# EAGLE design slang-lsm6dsl-ruka (EAGLE 9.4.2)

## Sheet 1 of 4: Power management
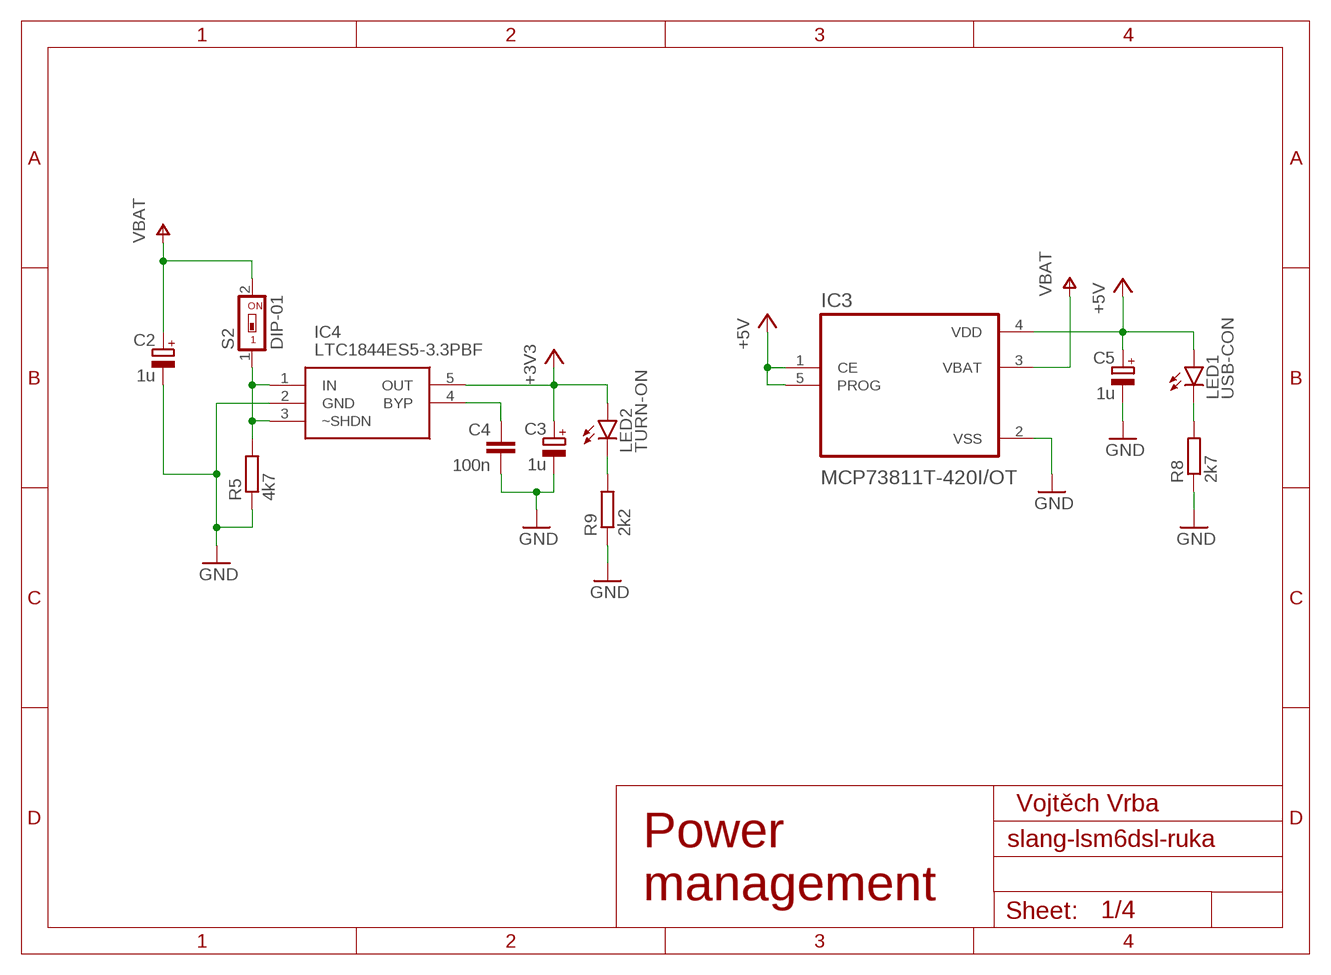
[diagram p0: schematic, sheet 1]

### Parts
C2  1u  CPOL-EUSMCA  [SMC_A]
C3  1u  CPOL-EUSMCA  [SMC_A]
C4  100n  C-EUC0805  [C0805]
C5  1u  CPOL-EUSMCA  [SMC_A]
IC3  MCP73811T-420I/OT  [SOT95P280X145-5N]
IC4  LTC1844ES5-3.3PBF  [SOT95P280X100-5N]
LED1  USB-CON  LEDCHIP-LED0805  [CHIP-LED0805]
LED2  TURN-ON  LEDCHIP-LED0805  [CHIP-LED0805]
R5  4k7  R-EU_R0805  [R0805]
R8  2k7  R-EU_R0805  [R0805]
R9  2k2  R-EU_R0805  [R0805]
S2  DIP-01  SWS001  [SMS-001]

### Nets
+3V3: C3.+ IC4.5(OUT) LED2.A ; also sheet 2,3,4
+5V: C5.+ IC3.1(CE) IC3.4(VDD) IC3.5(PROG) LED1.A ; also sheet 2
GND: C2.- C3.- C4.2 C5.- IC3.2(VSS) IC4.2(GND) R5.1 R8.1 R9.1 ; also sheet 2,3,4
N$5: LED1.C R8.2
N$7: C4.1 IC4.4(BYP)
N$9: IC4.1(IN) IC4.3(~SHDN) R5.2 S2.1
N$10: LED2.C R9.2
V+: C2.+ IC3.3(VBAT) S2.2 ; supply symbol labelled VBAT ; also sheet 2,4

### Notes on the sheet
- Vojtěch Vrba
- Power
  management

## Sheet 2 of 4: Connectors
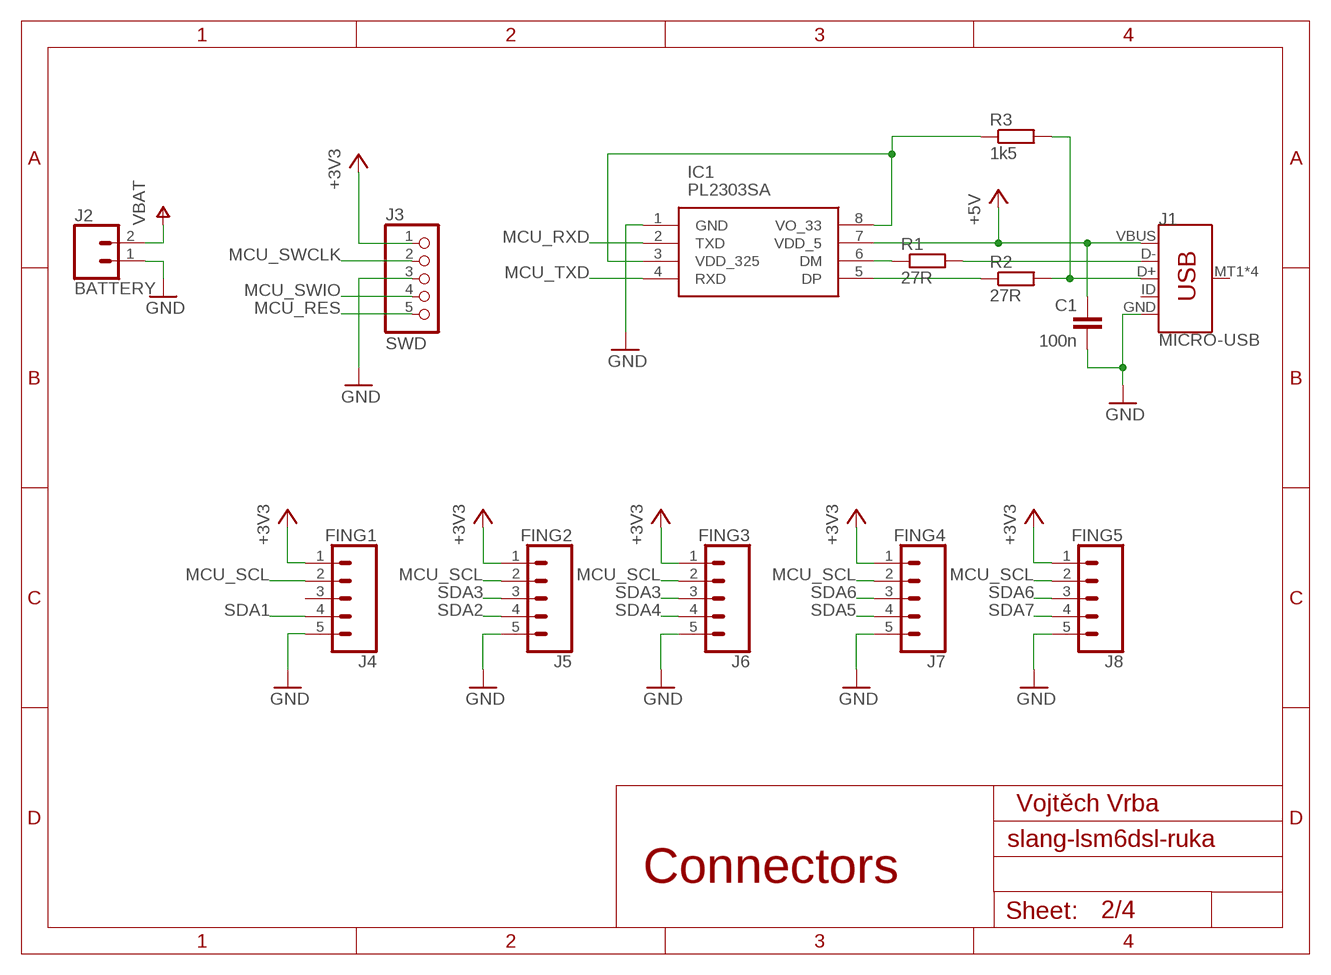
[diagram p1: schematic, sheet 2]

### Parts
C1  100n  C-EUC0805  [C0805]
IC1  PL2303SA  [SOIC127P600X170-8N]
J1  MICRO-USB  USB_MICRO-B_SMT  [USB-MICROB]
J2  BATTERY  CONN_025MM  [SCREWTERMINAL-5MM-2]
J3  SWD  PINHD-1X5/90  [1X05/90]
J4  FING1  CONN_051.27MM  [1X05_1.27MM]
J5  FING2  CONN_051.27MM  [1X05_1.27MM]
J6  FING3  CONN_051.27MM  [1X05_1.27MM]
J7  FING4  CONN_051.27MM  [1X05_1.27MM]
J8  FING5  CONN_051.27MM  [1X05_1.27MM]
R1  27R  R-EU_R0805  [R0805]
R2  27R  R-EU_R0805  [R0805]
R3  1k5  R-EU_R0805  [R0805]

### Nets
+3V3: J3.1 J4.1 J5.1 J6.1 J7.1 J8.1 ; also sheet 1,3,4
+5V: C1.1 IC1.7(VDD_5) J1.VBUS ; also sheet 1
GND: C1.2 IC1.1(GND) J1.GND J2.1 J3.3 J4.5 J5.5 J6.5 J7.5 J8.5 ; also sheet 1,3,4
MCU_RES: J3.5 ; also sheet 4
MCU_RXD: IC1.2(TXD) ; also sheet 4
MCU_SCL: J4.2 J5.2 J6.2 J7.2 J8.2 ; also sheet 3,4
MCU_SWCLK: J3.2 ; also sheet 4
MCU_SWIO: J3.4 ; also sheet 4
MCU_TXD: IC1.4(RXD) ; also sheet 4
N$1: IC1.6(DM) R1.1
N$2: J1.D- R1.2
N$3: J1.D+ R2.2 R3.2
N$4: IC1.5(DP) R2.1
N$6: IC1.3(VDD_325) IC1.8(VO_33) R3.1
SDA1: J4.4 ; also sheet 4
SDA2: J5.4 ; also sheet 4
SDA3: J5.3 J6.3 ; also sheet 4
SDA4: J6.4 ; also sheet 4
SDA5: J7.4 ; also sheet 4
SDA6: J7.3 J8.3 ; also sheet 4
SDA7: J8.4 ; also sheet 4
V+: J2.2 ; supply symbol labelled VBAT ; also sheet 1,4
Unconnected: J1.ID J1.MT1(SHIELD) J1.MT2(SHIELD) J1.P$1(SHIELD) J1.P$2(SHIELD) J4.3

### Notes on the sheet
- Vojtěch Vrba
- Connectors

## Sheet 3 of 4: Sensors
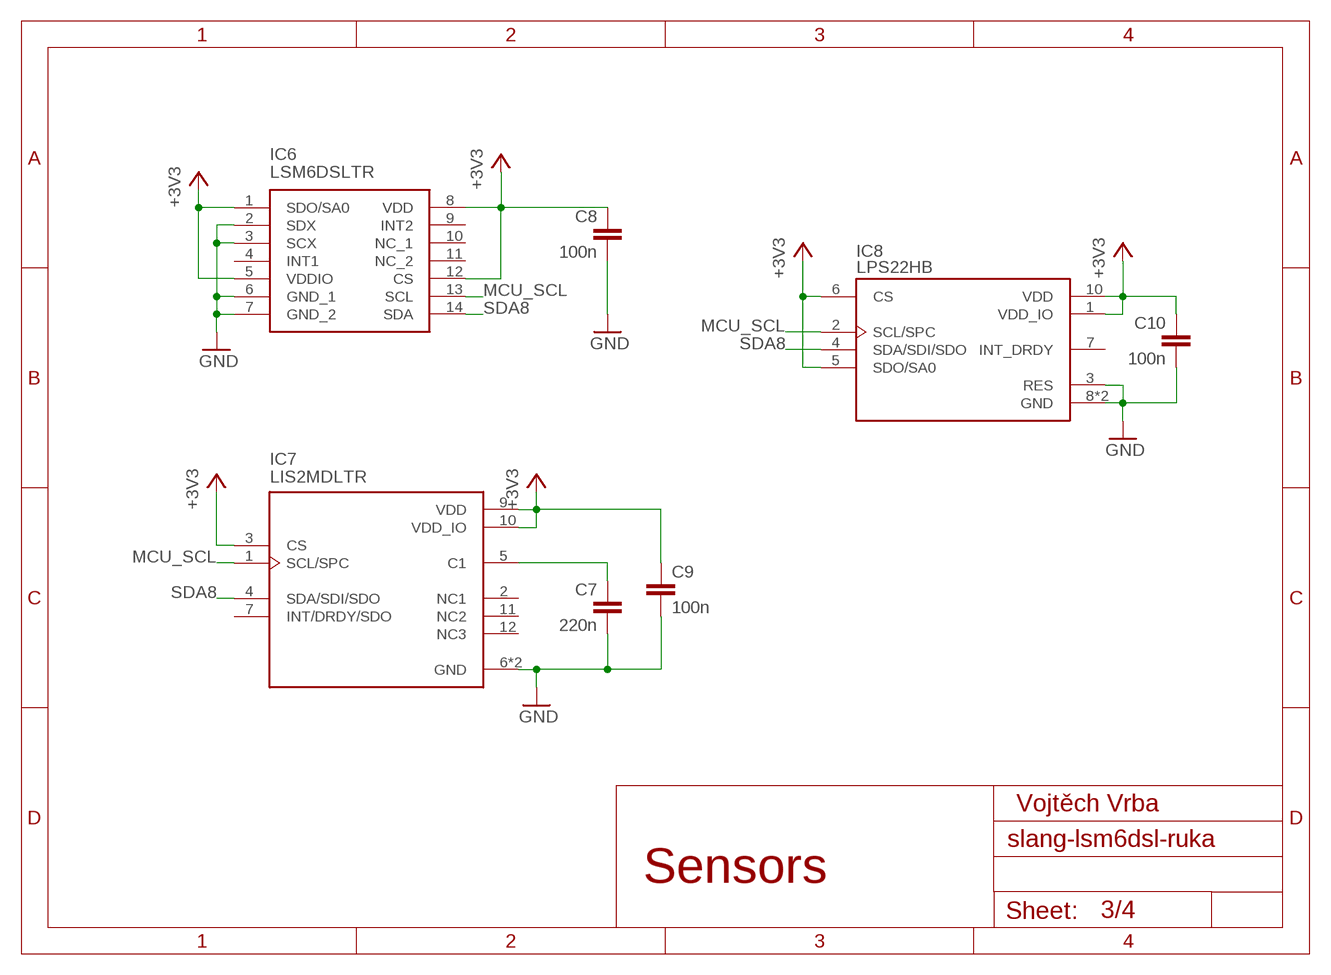
[diagram p2: schematic, sheet 3]

### Parts
C7  220n  C-EUC0805  [C0805]
C8  100n  C-EUC0805  [C0805]
C9  100n  C-EUC0805  [C0805]
C10  100n  C-EUC0805  [C0805]
IC6  LSM6DSLTR  [LGA-14(2.5X3X0.86)]
IC7  LIS2MDLTR  [PQFN50P200X200X70-12N]
IC8  LPS22HB  [LGA10R50P2X3_200X200X80]

### Nets
+3V3: C8.1 C9.1 C10.1 IC6.1(SDO/SA0) IC6.5(VDDIO) IC6.8(VDD) IC6.12(CS) IC7.3(CS) IC7.9(VDD) IC7.10(VDD_IO) IC8.1(VDD_IO) IC8.5(SDO/SA0) IC8.6(CS) IC8.10(VDD) ; also sheet 1,2,4
GND: C7.2 C8.2 C9.2 C10.2 IC6.2(SDX) IC6.3(SCX) IC6.6(GND_1) IC6.7(GND_2) IC7.6(GND) IC7.8(GND) IC8.3(RES) IC8.8(GND) IC8.9(GND) ; also sheet 1,2,4
MCU_SCL: IC6.13(SCL) IC7.1(SCL/SPC) IC8.2(SCL/SPC) ; also sheet 2,4
N$8: C7.1 IC7.5(C1)
SDA8: IC6.14(SDA) IC7.4(SDA/SDI/SDO) IC8.4(SDA/SDI/SDO) ; also sheet 4
Unconnected: IC6.4(INT1) IC6.9(INT2) IC6.10(NC_1) IC6.11(NC_2) IC7.2(NC1) IC7.7(INT/DRDY/SDO) IC7.11(NC2) IC7.12(NC3) IC8.7(INT_DRDY)

### Notes on the sheet
- Vojtěch Vrba
- Sensors

## Sheet 4 of 4: MCU
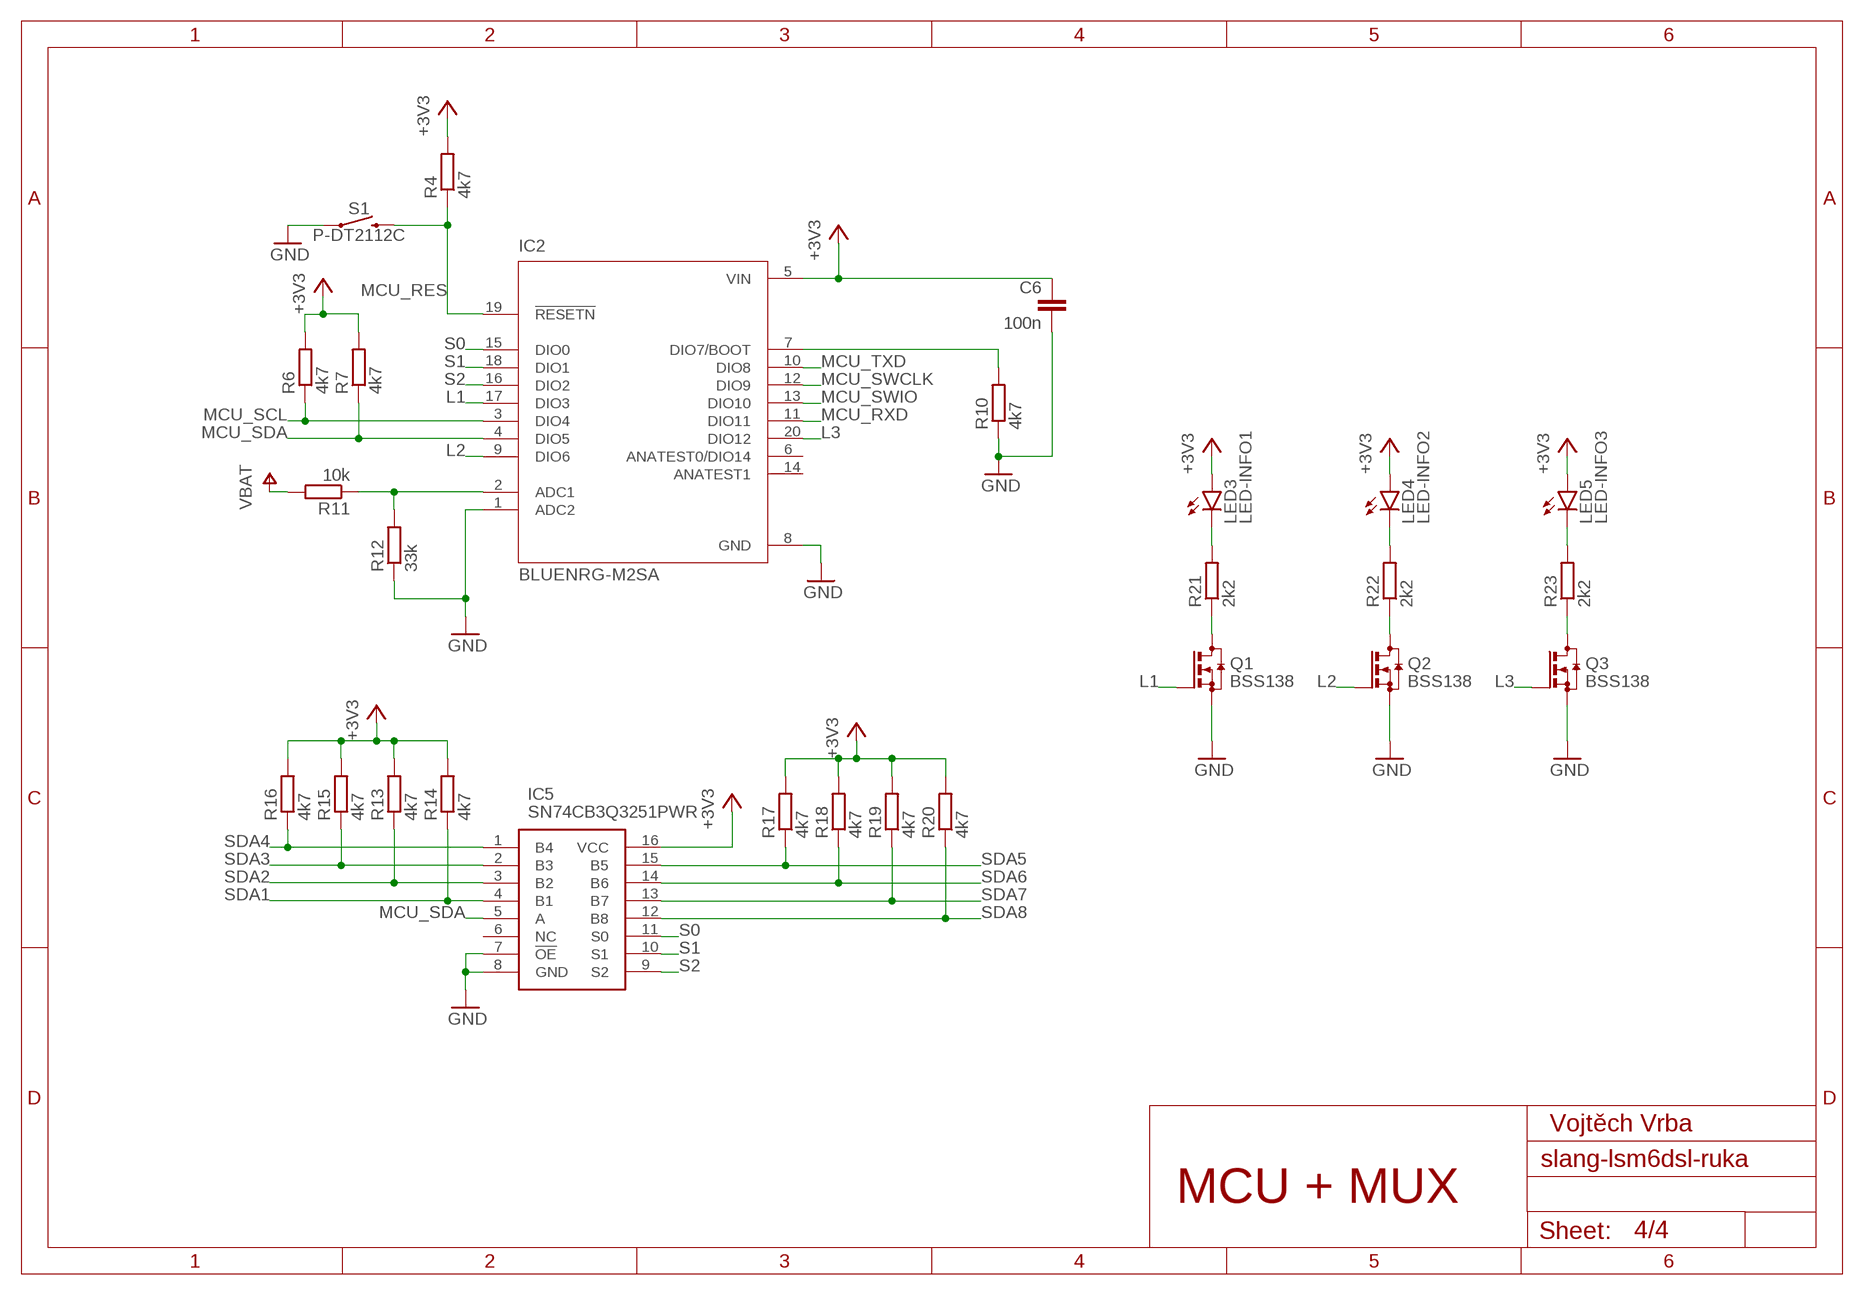
[diagram p3: schematic, sheet 4]

### Parts
C6  100n  C-EUC0805  [C0805]
IC2  BLUENRG-M2SA  [XCVR_BLUENRG-M2SA]
IC5  SN74CB3Q3251PWR  [SOP65P640X120-16N]
LED3  LED-INFO1  LEDCHIP-LED0805  [CHIP-LED0805]
LED4  LED-INFO2  LEDCHIP-LED0805  [CHIP-LED0805]
LED5  LED-INFO3  LEDCHIP-LED0805  [CHIP-LED0805]
Q1  BSS138  BSS123  [SOT23]
Q2  BSS138  BSS123  [SOT23]
Q3  BSS138  BSS123  [SOT23]
R4  4k7  R-EU_R0805  [R0805]
R6  4k7  R-EU_R0805  [R0805]
R7  4k7  R-EU_R0805  [R0805]
R10  4k7  R-EU_R0805  [R0805]
R11  10k  R-EU_R0805  [R0805]
R12  33k  R-EU_R0805  [R0805]
R13  4k7  R-EU_R0805  [R0805]
R14  4k7  R-EU_R0805  [R0805]
R15  4k7  R-EU_R0805  [R0805]
R16  4k7  R-EU_R0805  [R0805]
R17  4k7  R-EU_R0805  [R0805]
R18  4k7  R-EU_R0805  [R0805]
R19  4k7  R-EU_R0805  [R0805]
R20  4k7  R-EU_R0805  [R0805]
R21  2k2  R-EU_R0805  [R0805]
R22  2k2  R-EU_R0805  [R0805]
R23  2k2  R-EU_R0805  [R0805]
S1  P-DT2112C  MOMENTARY-SWITCH-SPST-SMD-6.0X3.5MM  [TACTILE_SWITCH_SMD_6.0X3.5MM]

### Nets
+3V3: C6.1 IC2.5(VIN) IC5.16(VCC) LED3.A LED4.A LED5.A R4.2 R6.2 R7.2 R13.2 R14.2 R15.2 R16.2 R17.2 R18.2 R19.2 R20.2 ; also sheet 1,2,3
GND: C6.2 IC2.1(ADC2) IC2.8(GND) IC5.7(!OE) IC5.8(GND) Q1.2(S) Q2.2(S) Q3.2(S) R10.1 R12.1 S1.1 ; also sheet 1,2,3
L1: IC2.17(DIO3) Q1.1(G)
L2: IC2.9(DIO6) Q2.1(G)
L3: IC2.20(DIO12) Q3.1(G)
MCU_RES: IC2.19(!RESETN) R4.1 S1.2 ; also sheet 2
MCU_RXD: IC2.11(DIO11) ; also sheet 2
MCU_SCL: IC2.3(DIO4) R6.1 ; also sheet 2,3
MCU_SDA: IC2.4(DIO5) IC5.5(A) R7.1
MCU_SWCLK: IC2.12(DIO9) ; also sheet 2
MCU_SWIO: IC2.13(DIO10) ; also sheet 2
MCU_TXD: IC2.10(DIO8) ; also sheet 2
N$11: IC2.7(DIO7/BOOT) R10.2
N$12: IC2.2(ADC1) R11.1 R12.2
N$13: LED3.C R21.2
N$14: Q1.3(D) R21.1
N$16: LED4.C R22.2
N$17: Q2.3(D) R22.1
N$19: LED5.C R23.2
N$20: Q3.3(D) R23.1
S0: IC2.15(DIO0) IC5.11(S0)
S1: IC2.18(DIO1) IC5.10(S1)
S2: IC2.16(DIO2) IC5.9(S2)
SDA1: IC5.4(B1) R14.1 ; also sheet 2
SDA2: IC5.3(B2) R13.1 ; also sheet 2
SDA3: IC5.2(B3) R15.1 ; also sheet 2
SDA4: IC5.1(B4) R16.1 ; also sheet 2
SDA5: IC5.15(B5) R17.1 ; also sheet 2
SDA6: IC5.14(B6) R18.1 ; also sheet 2
SDA7: IC5.13(B7) R19.1 ; also sheet 2
SDA8: IC5.12(B8) R20.1 ; also sheet 3
V+: R11.2 ; supply symbol labelled VBAT ; also sheet 1,2
Unconnected: IC2.6(ANATEST0/DIO14) IC2.14(ANATEST1) IC5.6(NC)

### Notes on the sheet
- Vojtěch Vrba
- MCU + MUX

## Library data of the parts
C1 C4 C6-C10 = resistor:C-EU: CAPACITOR, European symbol
C2 C3 C5 = resistor:CPOL-EU: POLARIZED CAPACITOR, European symbol
IC1 = PL2303SA:PL2303SA: PL2303SA (SOP8 Package) USB to Serial Bridge Controller Source: Datasheet <https://www.marutsu.co.jp/contents/shop/marutsu/datasheet/0000000200188008.pdf>; DESCRIPTION: PL2303SA (SOP8 Package) USB to Serial Bridge Controller; HEIGHT: 1.7mm; MANUFACTURER_NAME: Prolific; MANUFACTURER_PART_NUMBER: PL2303SA
IC2 = BLUENRG-M2SA:BLUENRG-M2SA: Very low power application processor module for Bluetooth Low Energy; AVAILABILITY: Unavailable; DESCRIPTION: Very low power application processor module for Bluetooth Low Energy; MF: STMicroelectronics; MP: BLUENRG-M2SA; PACKAGE: None; PRICE: None
IC3 = MCP73811T-420I_OT:MCP73811T-420I/OT; AVAILABILITY: Unavailable; DESCRIPTION: Charger IC Lithium Ion/Polymer SOT-23-5; MF: Microchip; MP: MCP73811T-420I/OT; PACKAGE: SOT-23 Microchip; PRICE: None
IC4 = LTC1844ES5-3.3PBF:LTC1844ES5-3.3PBF: Positive Fixed Linear Regulator Source: Datasheet; DESCRIPTION: Positive Fixed Linear Regulator; HEIGHT: mm; MANUFACTURER_NAME: Linear Technology; MANUFACTURER_PART_NUMBER: LTC1844ES5-3.3PBF
IC5 = SN74CB3Q3251PWR:SN74CB3Q3251PWR: 1-OF-8 FET MULTIPLEXER/DEMULTIPLEXER 2.5-V/3.3-V LOW-VOLTAGE HIGH-BANDWIDTH BUS SWITCH Source: Datasheet <http://www.ti.com/lit/ds/symlink/sn74cb3q3251.pdf>; DESCRIPTION: 1-OF-8 FET MULTIPLEXER/DEMULTIPLEXER 2.5-V/3.3-V LOW-VOLTAGE HIGH-BANDWIDTH BUS SWITCH; HEIGHT: 1.2mm; MANUFACTURER_NAME: Texas Instruments; MANUFACTURER_PART_NUMBER: SN74CB3Q3251PWR; MOUSER_PART_NUMBER: 595-SN74CB3Q3251PWR; MOUSER_PRICE-STOCK: https://www.mouser.com/Search/Refine.aspx?Keyword=595-SN74CB3Q3251PWR
IC6 = LSM6DSLTR:LSM6DSLTR: IMUs - Inertial Measurement Units iNEMO inertial module: 3D accelerometer and 3D gyroscope Source: Datasheet <http://www.st.com/content/ccc/resource/technical/document/datasheet/ee/23/a0/dc/1d/68/45/52/DM00237456.pdf/files/DM00237456.pdf/jcr:content/translations/en.DM00237456.pdf>; ARROW_PART_NUMBER: LSM6DSLTR; ARROW_PRICE-STOCK: https://www.arrow.com/en/products/lsm6dsltr/stmicroelectronics; DESCRIPTION: IMUs - Inertial Measurement Units iNEMO inertial module: 3D accelerometer and 3D gyroscope; HEIGHT: mm; MANUFACTURER_NAME: STMicroelectronics; MANUFACTURER_PART_NUMBER: LSM6DSLTR; RS_PART_NUMBER: 1639811P; RS_PRICE-STOCK: http://uk.rs-online.com/web/p/products/1639811P
IC7 = LIS2MDLTR:LIS2MDLTR: Ultra-Compact High-Performance e; AVAILABILITY: Unavailable; DESCRIPTION: Magnetoresistive Sensor X, Y, Z Axis 12-LGA _2x2_; MF: STMicroelectronics; MP: LIS2MDLTR; PACKAGE: WFLGA-12 STMicroelectronics; PRICE: None
IC8 = LPS22HB:LPS22HB: MEMS nano pressure sensor: 260-1260 hPa absolute digital output barometer; AVAILABILITY: Unavailable; DESCRIPTION: BlueNRG-MS, LPS22HB, LSM6DSM, LSM303AGR, MP34DT04, STM32L4 SensorTile Accelerometer, Gyroscope, Humidity, Magnetometer, Pressure, Temperature Sensor Evaluation Board; MF: STMicroelectronics; MP: LPS22HB; PACKAGE: WFLGA-10 STMicroelectronics; PRICE: None
J1 = SparkFun-Connectors:USB_MICRO-B: USB Type Micro-B Connector Male/female and PTH/SMT variants SparkFun Products: SparkFun microB USB Breakout <https://www.sparkfun.com/products/12035> SparkFun USB microB Plug Breakout <https://www.sparkfun.com/products/10031> SparkFun ESP8266 Thing <https://www.sparkfun.com/products/13231>; PROD_ID: CONN-09505; SF_ID: PRT-08533
J2 = SparkFun-Connectors:CONN_02: Multi connection point. Often used as Generic Header-pin footprint for 0.1 inch spaced/style header connections On any of the 0.1 inch spaced packages, you can populate with these: Break Away Headers - Straight <https://www.sparkfun.com/products/116> (PRT-00116) Break Away Male Headers - Right Angle <https://www.sparkfun.com/products/553> (PRT-00553) Female Headers <https://www.sparkfun.com/products/115> (PRT-00115) Break Away Headers - Machine Pin <https://www.sparkfun.com/products/117> (PRT-00117) Break Away Female Headers - Swiss Machine Pin <https://www.sparkfun.com/products/743> (PRT-00743) For SCREWTERMINALS and SPRING TERMINALS visit here: Screw Terimnals on SparkFun.com <https://www.sparkfun.com/search/results?term=Screw+Terminals> (5mm/3.5mm/2.54mm spacing) This device is also useful as a general connection point to wire up your design to another part of your project. Our various solder wires solder well into these plated through hole pads. Hook-Up Wire - Assortment (Stranded, 22 AWG) <https://www.sparkfun.com/products/11375> (PRT-11375) Hook-Up Wire - Assortment (Solid Core, 22 AWG) <https://www.sparkfun.com/products/11367> (PRT-11367) View the entire wire category on our website here <https://www.sparkfun.com/categories/141> Special notes: Molex polarized connector foot print use with: PRT-08233 with associated crimp pins and housings. 2.54_SCREWTERM for use with PRT-10571. 3.5mm Screw Terminal footprints for PRT-08084 5mm Screw Terminal footprints for use with PRT-08432; SF_SKU: PRT-08432
J3 = pinhead:PINHD-1X5: PIN HEADER
J4-J8 = SparkFun-Connectors:CONN_05: Multi connection point. Often used as Generic Header-pin footprint for 0.1 inch spaced/style header connections On any of the 0.1 inch spaced packages, you can populate with these: Break Away Headers - Straight <https://www.sparkfun.com/products/116> (PRT-00116) Break Away Male Headers - Right Angle <https://www.sparkfun.com/products/553> (PRT-00553) Female Headers <https://www.sparkfun.com/products/115> (PRT-00115) Break Away Headers - Machine Pin <https://www.sparkfun.com/products/117> (PRT-00117) Break Away Female Headers - Swiss Machine Pin <https://www.sparkfun.com/products/743> (PRT-00743) For SCREWTERMINALS and SPRING TERMINALS visit here: Screw Terimnals on SparkFun.com <https://www.sparkfun.com/search/results?term=Screw+Terminals> (5mm/3.5mm/2.54mm spacing) This device is also useful as a general connection point to wire up your design to another part of your project. Our various solder wires solder well into these plated through hole pads. Hook-Up Wire - Assortment (Stranded, 22 AWG) <https://www.sparkfun.com/products/11375> (PRT-11375) Hook-Up Wire - Assortment (Solid Core, 22 AWG) <https://www.sparkfun.com/products/11367> (PRT-11367) View the entire wire category on our website here <https://www.sparkfun.com/categories/141> Special notes: Molex polarized connector foot print use with SKU : PRT-08231 with associated crimp pins and housings. 1MM SMD Version SKU: PRT-10208
LED1-LED5 = led:LED: LED OSRAM: - CHIPLED LG R971, LG N971, LY N971, LG Q971, LY Q971, LO R971, LY R971 LH N974, LH R974 LS Q976, LO Q976, LY Q976 LO Q996 - Hyper CHIPLED LW Q18S LB Q993, LB Q99A, LB R99A - SideLED LS A670, LO A670, LY A670, LG A670, LP A670 LB A673, LV A673, LT A673, LW A673 LH A674 LY A675 LS A676, LA A676, LO A676, LY A676, LW A676 LS A679, LY A679, LG A679 - Hyper Micro SIDELED® LS Y876, LA Y876, LO Y876, LY Y876 LT Y87S - SmartLED LW L88C, LW L88S LB L89C, LB L89S, LG L890 LS L89K, LO L89K, LY L89K LS L896, LA L896, LO L896, LY L896 - TOPLED LS T670, LO T670, LY T670, LG T670, LP T670 LSG T670, LSP T670, LSY T670, LOP T670, LYG T670 LG T671, LOG T671, LSG T671 LB T673, LV T673, LT T673, LW T673 LH T674 LS T676, LA T676, LO T676, LY T676, LB T676, LH T676, LSB T676, LW T676 LB T67C, LV T67C, LT T67C, LS T67K, LO T67K, LY T67K, LW E67C LS E67B, LA E67B, LO E67B, LY E67B, LB E67C, LV E67C, LT E67C LW T67C LS T679, LY T679, LG T679 LS T770, LO T770, LY T770, LG T770, LP T770 LB T773, LV T773, LT T773, LW T773 LH T774 LS E675, LA E675, LY E675, LS T675 LS T776, LA T776, LO T776, LY T776, LB T776 LHGB T686 LT T68C, LB T68C - Hyper Mini TOPLED® LB M676 - Mini TOPLED Santana® LG M470 LS M47K, LO M47K, LY M47K Source: http://www.osram.convergy.de LUXEON: - LUMILED® LXK2-PW12-R00, LXK2-PW12-S00, LXK2-PW14-U00, LXK2-PW14-V00 LXK2-PM12-R00, LXK2-PM12-S00, LXK2-PM14-U00 LXK2-PE12-Q00, LXK2-PE12-R00, LXK2-PE12-S00, LXK2-PE14-T00, LXK2-PE14-U00 LXK2-PB12-K00, LXK2-PB12-L00, LXK2-PB12-M00, LXK2-PB14-N00, LXK2-PB14-P00, LXK2-PB14-Q00 LXK2-PR12-L00, LXK2-PR12-M00, LXK2-PR14-Q00, LXK2-PR14-R00 LXK2-PD12-Q00, LXK2-PD12-R00, LXK2-PD12-S00 LXK2-PH12-R00, LXK2-PH12-S00 LXK2-PL12-P00, LXK2-PL12-Q00, LXK2-PL12-R00 Source: www.luxeon.com KINGBRIGHT: KA-3528ASYC Source: www.kingbright.com
Q1-Q3 = transistor-small-signal:BSS123: N-CHANNEL MOS FET
R1-R23 = resistor:R-EU_: RESISTOR, European symbol
S1 = SparkFun-Switches:MOMENTARY-SWITCH-SPST: Momentary Switch (Pushbutton) - SPST Normally-open (NO) SPST momentary switches (buttons, pushbuttons). Variants PTH-12MM - 12mm square, through-hole Momentary Pushbutton Switch - 12mm Square <https://www.sparkfun.com/products/9190> (COM-09190) PTH-6.0MM, PTH-6.0MM-KIT - 6.0mm square, through-hole Mini Pushbutton Switch <https://www.sparkfun.com/products/97> (COM-00097) KIT package intended for soldering kit's - only one side of pads' copper is exposed. PTH-RIGHT-ANGLE-KIT - Right-angle, through-hole Right Angle Tactile Button <https://www.sparkfun.com/products/10791> - Used on SparkFun BigTime Watch Kit <https://www.sparkfun.com/products/11734> SMD-12MM - 12mm square, surface-mount Tactile Button - SMD (12mm) <https://www.sparkfun.com/products/12993> (COM-12993) Used on SparkFun PicoBoard <https://www.sparkfun.com/products/11888> SMD-4.5MM - 4.5mm Square Trackball Switch Used on SparkFun Blackberry Trackballer Breakout <https://www.sparkfun.com/products/13169> SMD-4.6MMX2.8MM - 4.60mm x 2.80mm, surface mount Used on SparkFun SAMD21 Mini Breakout <https://www.sparkfun.com/products/13664> SMD-5.2MM, SMD-5.2-REDUNDANT - 5.2mm square, surface-mount Mini Pushbutton Switch - SMD <https://www.sparkfun.com/products/8720> (COM-08720) Used on Arduino Pro Mini <https://www.sparkfun.com/products/11114> REDUNDANT package connects both switch circuits together SMD-6.0X3.5MM - 6.0 x 3.5mm, surface mount Momentary Reset Switch SMD <https://www.sparkfun.com/products/8229> (COM-08229) SMD-6.2MM-TALL - 6.2mm square, surface mount Tactile Button - SMD (6mm) <https://www.sparkfun.com/products/12992> Used on SparkFun Digital Sandbox <https://www.sparkfun.com/products/12651> SMD-RIGHT-ANGLE - Right-angle, surface mount Used on SparkFun Block for Intel® Edison - Arduino <https://www.sparkfun.com/products/13036>; PROD_ID: SWCH-00815; SF_SKU: COM-08229
S2 = smd-special:SWS001: SMD Dip Switch 1 pol.

## Board
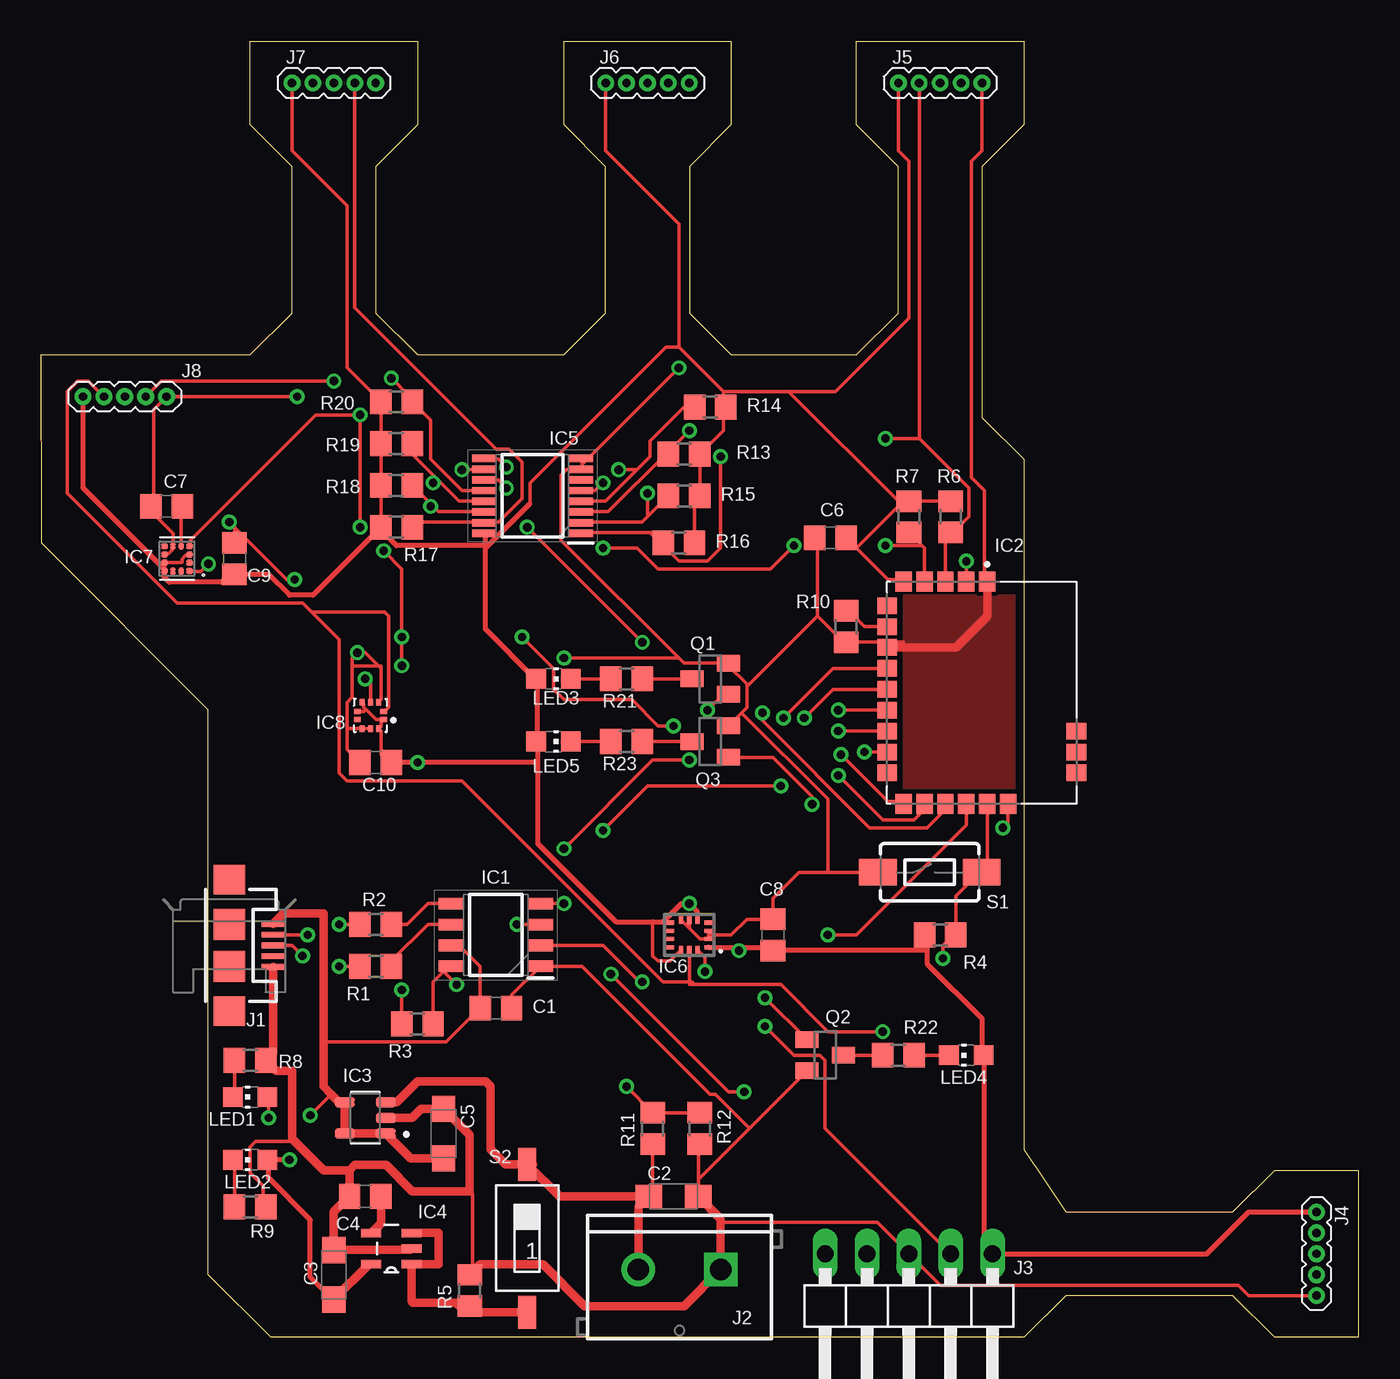
[diagram p4: board, top side]
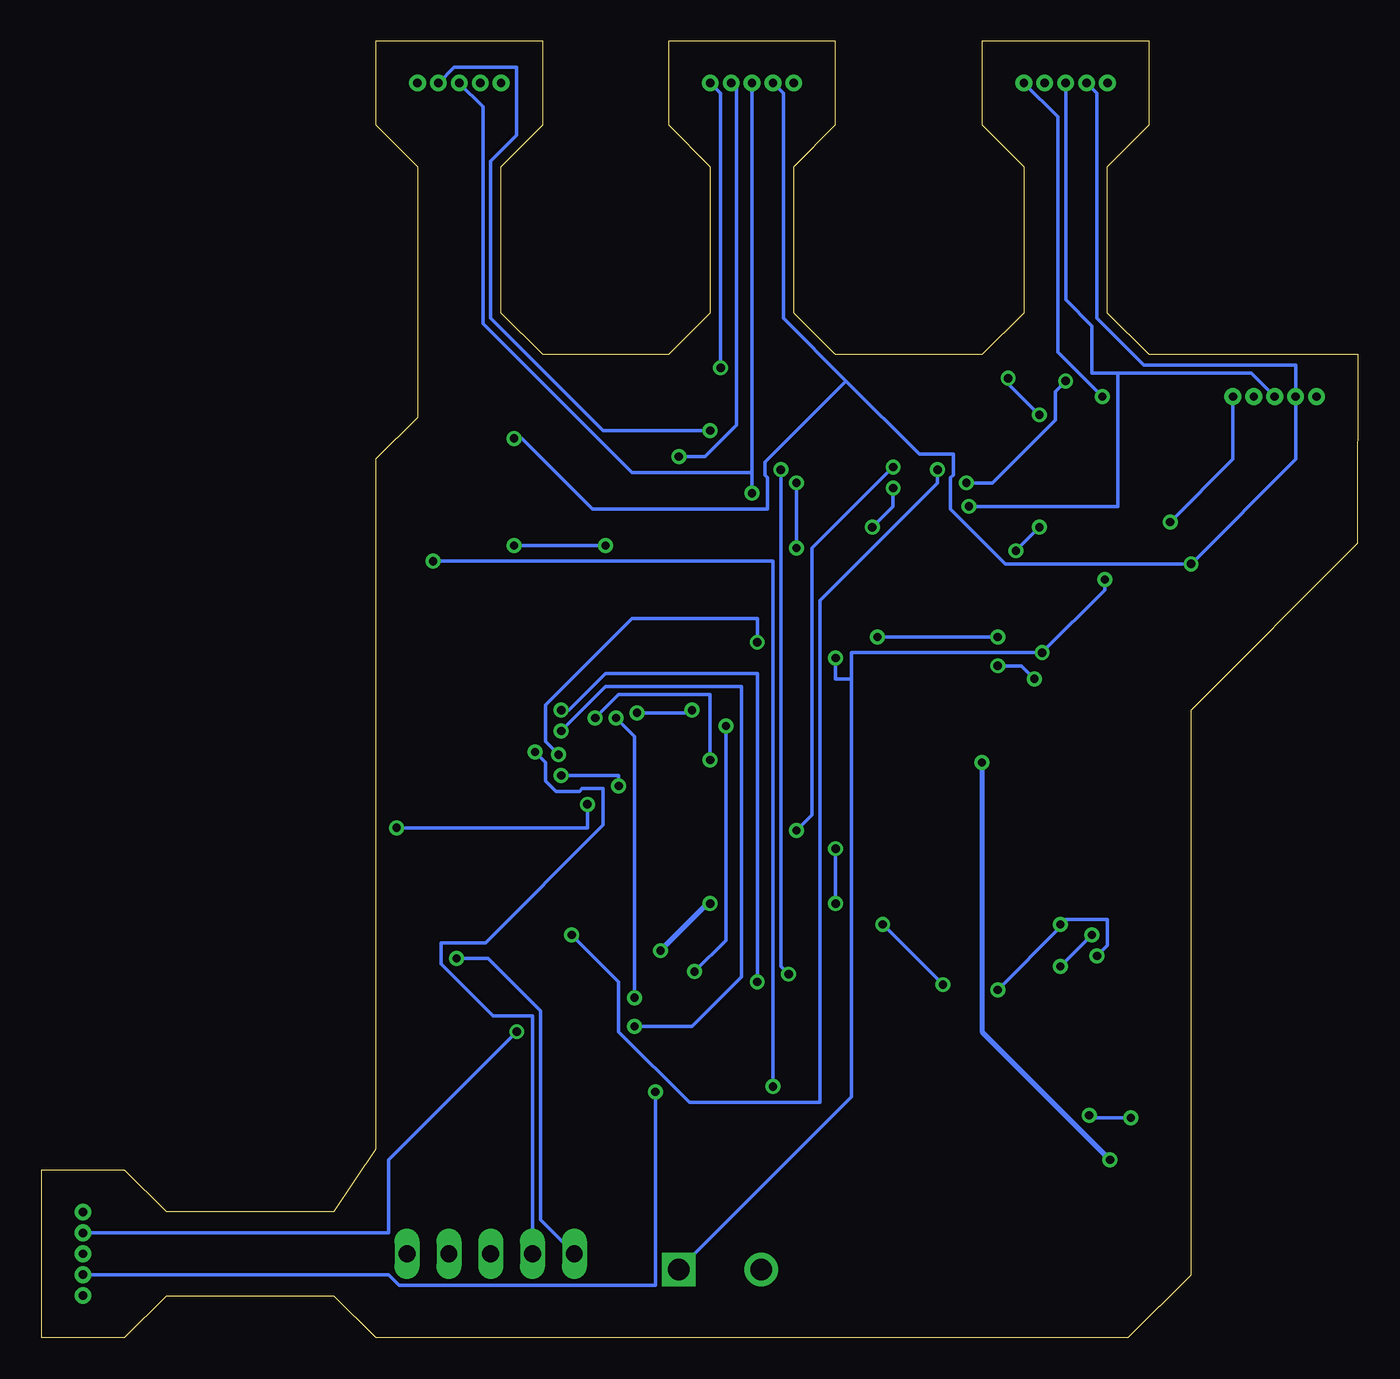
[diagram p5: board, bottom side, seen from below]

Size 80.01 x 78.74 mm. Coordinates in mm from the lower left corner, seen from the top.
Outline: 80.01,0 74.93,0 72.39,2.54 62.23,2.54 59.69,0 13.97,0 10.16,3.81 10.16,38.1 0.02,48.24 0.02,49.2 0,59.69 12.7,59.69 15.24,62.23 15.24,71.12 12.7,73.66 12.7,78.74 22.86,78.74 22.86,73.66 20.32,71.12 20.32,62.23 22.86,59.69 31.75,59.69 34.29,62.23 34.29,71.12 31.75,73.66 31.75,78.74 41.91,78.74 41.91,73.66 39.37,71.12 39.37,62.23 41.91,59.69 49.53,59.69 52.07,62.23 52.07,71.12 49.53,73.66 49.53,78.74 59.69,78.74 59.69,73.66 57.15,71.12 57.15,55.88 59.69,53.34 59.69,11.43 62.23,7.62 72.39,7.62 74.93,10.16 80.01,10.16 80.01,0
Copper layers (1*16): Top 0.035mm / dielectric 1.5mm / Bottom 0.035mm
Design rules "default *": minimum track width 8mil, minimum drill 0.5mm, track to track 6mil, track to pad 6mil, pad to pad 6mil, via to via 12mil, smd to smd 6mil, copper to edge 20mil, drill to drill 6mil, minimum pad ring 10mil, minimum via ring 8mil, stop-mask expansion 4mil, vias tented up to drill 0mil, thermal gap 10mil
bRestrict: area 50.8,31.8 to 60,46.4

### Footprints (pad centres in the part's own frame; a part is rotated, then mirrored left to right if it is on the bottom)
C0805 = smd 1.3 x 1.5: 1 -0.95,0; 2 0.95,0
SMC_A = smd 1.6 x 1.4: + -1.5,0; - 1.5,0
SOIC127P600X170-8N = smd 1.525 x 0.7: 1 -2.712,1.905; 2 -2.712,0.635; 3 -2.712,-0.635; 4 -2.712,-1.905; 5 2.712,-1.905; 6 2.712,-0.635; 7 2.712,0.635; 8 2.712,1.905
XCVR_BLUENRG-M2SA = smd 1.2 x 1: 1 -11.62,1.27; 2 -11.62,0; 3 -11.62,-1.27; 4 -11.62,-2.54; 5 -11.62,-3.81; 15 1.88,-3.81; 16 1.88,-2.54; 17 1.88,-1.27; 18 1.88,0; 19 1.88,1.27; 20 1.88,2.54 | smd 1 x 1.2: 6 -10.16,-4.81; 7 -8.89,-4.81; 8 -7.62,-4.81; 9 -6.35,-4.81; 10 -5.08,-4.81; 11 -3.81,-4.81; 12 -2.54,-4.81; 13 -1.27,-4.81; 14 0,-4.81; 21 0,6.69; 22 -1.27,6.69; 23 -2.54,6.69
SOT95P280X145-5N = smd 1.22 x 0.6: 1 -1.245,0.95; 2 -1.245,0; 3 -1.245,-0.95; 4 1.245,-0.95; 5 1.245,0.95
SOT95P280X100-5N = smd 1.219 x 0.508: 1 -1.219,0.94; 2 -1.219,0; 3 -1.219,-0.94; 4 1.219,-0.94; 5 1.219,0.94
SOP65P640X120-16N = smd 1.475 x 0.45: 1 -2.938,2.275; 2 -2.938,1.625; 3 -2.938,0.975; 4 -2.938,0.325; 5 -2.938,-0.325; 6 -2.938,-0.975; 7 -2.938,-1.625; 8 -2.938,-2.275; 9 2.938,-2.275; 10 2.938,-1.625; 11 2.938,-0.975; 12 2.938,-0.325; 13 2.938,0.325; 14 2.938,0.975; 15 2.938,1.625; 16 2.938,2.275
LGA-14(2.5X3X0.86) = smd 0.475 x 0.25: 1 -1.163,0.75; 2 -1.163,0.25; 3 -1.163,-0.25; 4 -1.163,-0.75; 8 1.163,-0.75; 9 1.163,-0.25; 10 1.163,0.25; 11 1.163,0.75 | smd 0.25 x 0.475: 5 -0.5,-0.912; 6 0,-0.912; 7 0.5,-0.912; 12 0.5,0.912; 13 0,0.912; 14 -0.5,0.912
PQFN50P200X200X70-12N = smd 0.41 x 0.35: 1 -0.76,0.75; 2 -0.76,0.25; 3 -0.76,-0.25; 4 -0.76,-0.75; 7 0.76,-0.75; 8 0.76,-0.25; 9 0.76,0.25; 10 0.76,0.75 | smd 0.35 x 0.41: 5 -0.25,-0.76; 6 0.25,-0.76; 11 0.25,0.76; 12 -0.25,0.76
LGA10R50P2X3_200X200X80 = smd 0.4 x 0.3: 1 -0.8,0.25; 2 -0.8,-0.25; 6 0.8,-0.25; 7 0.8,0.25 | smd 0.3 x 0.4: 3 -0.5,-0.8; 4 0,-0.8; 5 0.5,-0.8; 8 0.5,0.8; 9 0,0.8; 10 -0.5,0.8
USB-MICROB = smd 1.4 x 0.35: D+ -2.65,0; D- -2.65,-0.65; GND -2.65,1.3; ID -2.65,0.65; VBUS -2.65,-1.3 | smd 1.9 x 1.8: MT1 0,-4; MT2 0,4 | smd 1.9 x 1.9: P$1 0,-1.27; P$2 0,1.27
SCREWTERMINAL-5MM-2 = drill 1.3 pad 2.032 square: 1 0,0 | drill 1.3 pad 2.032: 2 5,0
1X05/90 = drill 1.016 long: 1 -5.08,-3.81; 2 -2.54,-3.81; 3 0,-3.81; 4 2.54,-3.81; 5 5.08,-3.81
1X05_1.27MM = drill 0.508 pad 1: 1 0,0; 2 1.27,0; 3 2.54,0; 4 3.81,0; 5 5.08,0
CHIP-LED0805 = smd 1.2 x 1.2: A 0,-1.05; C 0,1.05
SOT23 = smd 1 x 1.4: 1 -0.95,-1.1; 2 0.95,-1.1; 3 0,1.1
R0805 = smd 1.3 x 1.5: 1 -0.95,0; 2 0.95,0
TACTILE_SWITCH_SMD_6.0X3.5MM = smd 2.3 x 1.6: 1 -3.15,0; 2 3.15,0
SMS-001 = smd 1.092 x 2.007: 1 0,-4.496; 2 0,4.496

### Placement (x,y rotation side)
C1  27.62,20 0 top
C2  38.42,8.57 0 top
C3  17.78,3.81 90 top
C4  19.68,8.57 180 top
C5  24.45,12.38 90 top
C6  47.94,48.58 180 top
C7  7.62,50.48 180 top
C8  44.45,24.45 90 top
C9  11.75,47.31 90 top
C10  20.32,34.92 180 top
IC1  27.62,24.45 180 top
IC2  56.2,34.29 270 top
IC3  19.68,13.34 180 top
IC4  21.27,5.4 180 top
IC5  29.84,51.12 180 top
IC6  39.37,24.45 180 top
IC7  8.26,47.31 180 top
IC8  20,37.78 180 top
J1  11.43,23.81 180 top
J2  41.27,4.13 180 top
J3  52.7,1.27 180 top
J4  77.47,7.62 270 top
J5  52.07,76.2 0 top
J6  34.29,76.2 0 top
J7  15.24,76.2 0 top
J8  2.54,57.15 0 top
LED1  12.7,14.61 90 top
LED2  12.7,10.79 90 top
LED3  31.11,40.01 270 top
LED4  56.2,17.14 90 top
LED5  31.11,36.2 270 top
Q1  40.64,40.01 90 top
Q2  47.62,17.14 270 top
Q3  40.64,36.2 90 top
R1  20.32,22.54 180 top
R2  20.32,25.08 180 top
R3  22.86,19.05 180 top
R4  54.61,24.45 180 top
R5  26.04,2.86 270 top
R6  55.24,49.85 90 top
R7  52.7,49.85 90 top
R8  12.7,16.83 180 top
R9  12.7,7.94 180 top
R10  48.9,43.18 90 top
R11  37.15,12.7 270 top
R12  40.01,12.7 90 top
R13  39.05,53.66 0 top
R14  40.64,56.52 0 top
R15  39.05,51.12 0 top
R16  38.73,48.26 0 top
R17  21.59,49.21 180 top
R18  21.59,51.75 180 top
R19  21.59,54.29 180 top
R20  21.59,56.83 180 top
R21  35.56,40.01 180 top
R22  52.07,17.14 0 top
R23  35.56,36.2 180 top
S1  53.98,28.26 0 top
S2  29.53,6.03 0 top

### Tracks (layer width: path | path; a pad name or v marks a point on that pad's centre or on a via)
+3V3  (via drill 0.5)
  Top 0.203: IC8.5 19.6,38.49 19.6,38.28 19.73,38.15 | 19.73,38.15 20.34,37.53 20.64,37.53 | 20.64,37.53 IC8.1 | IC8.6 19.62,38.03 19.73,38.15 | 20.64,37.53 20.64,37.12 IC8.10 20.64,36.83 20.64,35.4 21.11,34.92 C10.1 | IC7.3 8.94,47.49 8.76,47.49 8.56,47.29 8.56,47.1 8.52,47.06 IC7.9 IC7.10 7.46,46.51 | 44.25,23.7 C8.1 | 57.15,17.14 LED4.A 57.31,17.14 | 53.82,24.45 R4.2 | R7.2 R6.2 | 49.53,47.94 C6.1 49.53,47.94 | 49.53,47.94 51.44,46.04 52.39,46.04 IC2.5 | 52.23,50.64 52.7,50.64 R7.2 | 49.53,47.94 52.23,50.64 | R16.2 39.69,50.96 39.85,51.12 R15.2 R13.2 | 41.43,56.52 41.43,55.09 R13.2 | R13.2 | J6.1 34.29,72.07 38.73,67.63 38.73,60.17 | 41.43,57.47 38.73,60.17 | 41.43,56.52 41.43,57.47 | 41.43,56.52 R14.2 | J5.1 52.07,72.07 52.7,71.44 52.7,61.91 48.26,57.47 45.4,57.47 | 41.43,57.47 45.4,57.47 | 45.4,57.47 52.23,50.64 | 52.23,50.64 R7.2 | R18.2 R17.2 20.8,49.21 20.8,48.9 | R20.2 R19.2 | J7.1 15.24,72.07 18.57,68.74 18.57,58.9 R20.2 | R20.2 | R19.2 R18.2 | R18.2 | R19.2 | 11.43,46.35 C9.1 | C3.+ 17.69,2.31 | 37.78,25.24 38.1,25.24 IC6.8 | 30.16,40.01 LED3.A 30,40.01 | 30.16,36.2 LED5.A | 26.99,47.94 26.99,48.1 | 26.99,48.74 IC5.16 | 13.81,10.79 LED2.A | 38.73,60.17 37.94,60.17 29.69,51.91 29.69,50.64 | v42.39,23.5 42.39,23.7 | 39.85,25.88 39.85,25.4 IC6.5 | IC6.12 38.2,22.86 37.47,22.86 37.15,23.18 37.15,25.24
  Top 0.305: IC6.1 42.39,23.7 44.25,23.7 | 57.15,17.14 57.15,19.37 53.82,22.7 53.82,23.5 | 53.82,24.45 53.82,23.5 | 53.82,23.5 C8.1 | J4.1 73.34,7.62 70.8,5.08 J3.1 57.31,5.56 57.31,17.14 | 7.46,46.51 7.46,46.2 7.78,45.88 10.95,45.88 11.43,46.35 | J8.1 2.54,51.59 7.46,46.67 IC7.10 | C9.1 13.81,46.35 15.08,45.09 16.51,45.09 R17.2 | 17.69,2.31 16.35,3.65 16.35,7.14 13.81,9.68 13.81,10.79 v15.08,10.79 | 30.16,34.92 30.16,36.2 30.16,40.01 | 30.16,34.92 30.16,30 34.92,25.24 37.15,25.24 37.78,25.24 38.89,26.35 v39.37,26.35 39.85,25.88 | 26.99,48.74 26.99,48.1 21.59,48.1 20.8,48.9 | 30,40.01 26.99,43.02 26.99,47.94 29.69,50.64 | 30.16,34.92 v22.86,34.92 C10.1
  Top 0.508: C3.+ 19.93,4.46 IC4.5
  Bottom 0.203: v39.37,26.35 39.53,26.35
  Bottom 0.305: v15.08,10.79 22.86,18.57 v22.86,34.92 | v42.39,23.5 39.53,26.35
+5V  (via drill 0.5)
  Top 0.203: v13.81,13.34 13.81,14.61 LED1.A | 17.62,14.76 v16.35,13.49 | C1.1 26.67,22.54 25.4,23.81 IC1.7 | 17.14,17.94 24.61,17.94 C1.1 | C1.1
  Top 0.508: C5.+ 22.43,10.88 IC3.1 IC3.5 IC3.4 18.1,14.29 17.62,14.76 17.14,15.24 17.14,17.94 17.14,25.75 14.71,25.75 J1.VBUS
  Bottom 0.203: v13.81,13.34 16.35,13.34 v16.35,13.49
GND  (via drill 0.5)
  Top 0.203: IC8.9 IC8.8 19.37,36.99 18.57,36.99 | IC6.7 39.37,24.86 | 39.37,24.86 40.03,24.2 IC6.2 40.53,24.45 | IC6.6 39.37,24.86 | IC6.3 40.53,24.45 | IC7.8 7.57,47.63 7.75,47.63 7.95,47.83 7.95,48.02 IC7.6 8.01,48.83 6.83,50.01 6.83,50.48 | C2.- 39.92,9.68 | 39.92,9.68 39.92,11.66 R12.1 | 40.53,24.45 41.91,24.45 42.86,25.4 C8.2 44.45,26.67 46.04,28.26 47.78,28.26 | J4.5 73.34,2.54 72.71,3.17 54.61,3.17 J3.3 50.8,6.99 41.27,6.99 | C1.2 28.57,20.8 IC1.1 32.86,22.54 40.64,14.76 40.96,14.76 43.02,12.7 | R9.1 13.49,7.94 13.49,9.21 12.7,10 12.7,11.59 13.02,11.91 15.08,11.91 15.24,12.06 | 43.02,12.7 40.01,9.68 39.92,9.68 | 43.02,12.7 Q2.2 | 26.04,8.89 26.19,8.73 26.19,4.29 R5.1 | 20.64,40.64 20.64,40.8 18.89,40.8 | 20.64,40.64 20.64,38.73 IC8.3 | 18.57,36.99 18.57,35.72 C10.2 | 18.57,36.99 18.57,38.58 18.89,38.89 18.89,41.27 v19.21,41.59 19.68,41.59 20.64,40.64 | C9.2 11.75,49.21 v11.43,49.53 14.92,46.04 v15.4,46.04 | 6.83,50.48 6.83,56.36 J8.5 v15.56,57.15 | 6.83,50.48 C7.2 | 52.39,42.23 R10.1 48.9,42.39 48.58,42.39 47.15,43.81 | 47.15,43.81 47.15,48.58 C6.2 | J5.5 57.15,72.07 56.52,71.44 56.52,52.23 57.31,51.44 57.31,46.04 IC2.1 | 47.78,28.26 S1.1 | 32.86,53.02 32.86,53.34 IC5.8 | 32.86,53.02 32.86,52.86 IC5.7 32.7,52.7 31.91,52.7 31.59,52.39 31.59,48.42 38.73,41.27 | 42.55,37.94 42.86,38.26 42.86,39.53 | 42.55,37.94 Q3.2 | 42.86,39.53 42.86,39.69 41.75,40.8 Q1.2 41.59,40.96 39.05,40.96 38.73,41.27 | 32.86,53.02 v38.73,58.9 | 47.78,28.26 47.78,32.7 42.55,37.94 | 42.86,39.53 47.15,43.81 | 38.73,41.27 v31.75,41.27
  Top 0.508: IC3.2 22.54,13.34 23.09,13.88 C5.- 26.04,12.29 26.04,8.89 22.54,8.89 20.95,10.48 19.05,10.48 18.73,10.16 | IC4.2 22.4,5.31 C3.- 17.78,7.62 C4.2 | C2.- 41.27,7.21 41.27,6.99 J2.1 39.05,1.91 33.02,1.91 30.48,4.45 26.67,4.45 R5.1 | J1.GND 14.08,17.26 R8.1 14.29,16.19 15.24,16.19 15.24,12.06 17.14,10.16 18.73,10.16 | 18.73,10.16 C4.2 | C4.2 | IC2.1 57.47,43.81 55.56,41.91 IC2.8
  Bottom 0.203: v11.43,49.53 7.62,53.34 J8.5 | J7.5 18.26,74.14 18.26,59.85 v15.56,57.15 | v15.4,46.04 15.4,45.4 v19.21,41.59 30.8,41.59 30.8,40.01 | J6.5 38.73,75.56 v38.73,58.9 | 30.8,40.01 31.75,40.01 v31.75,41.27 | J2.1 30.8,14.61 30.8,40.01
  pour Top: 59.69,33.34 52.39,33.34 52.39,45.09 59.69,45.09
L1  (via drill 0.5)
  Top 0.203: IC2.17 54.93,32.07 53.82,30.96 50.32,30.96 43.81,37.47 v43.81,37.94 | v40.48,38.1 41.59,39.21 Q1.1
  Bottom 0.203: v43.81,37.94 40.48,37.94 v40.48,38.1
L2  (via drill 0.5)
  Top 0.203: IC2.9 48.1,40.64 v45.09,37.62 | v43.97,20.64 Q2.1
  Bottom 0.203: v45.09,37.62 43.97,36.51 v43.97,20.64
L3  (via drill 0.5)
  Top 0.203: IC2.20 58.74,31.27 v58.42,30.96 | v46.83,32.38 46.83,32.86 44.45,35.24 Q3.1
  Bottom 0.203: v58.42,30.96 46.83,30.96 v46.83,32.38
MCU_RES  (via drill 0.5)
  Top 0.203: IC2.19 57.47,28.57 57.15,28.26 S1.2 56.99,28.26 55.56,26.83 R4.1 55.4,24.45 54.77,23.81 v54.77,23.02
  Bottom 0.203: J3.5 49.69,7.14 49.69,19.84 52.86,23.02 v54.77,23.02
MCU_RXD  (via drill 0.5)
  Top 0.203: v48.42,38.1 IC2.11 | v36.51,21.59 36.35,21.59 34.13,23.81 IC1.2
  Bottom 0.203: v48.42,38.1 47.94,38.1 45.72,40.32 36.51,40.32 v36.51,21.59
MCU_SCL  (via drill 0.5)
  Top 0.203: 54.93,48.42 54.93,48.58 R6.1 54.93,48.42 | 54.93,48.42 IC2.3 | 53.34,54.61 J5.2 | 53.34,54.61 56.36,51.59 56.36,49.85 54.93,48.42 | 16.43,44.05 15.88,44.61 8.26,44.61 1.59,51.28 1.59,57.47 2.22,58.1 2.86,58.1 J8.2 | 16.43,44.05 18.1,42.39 18.1,34.29 18.57,33.81 25.56,33.81 37.78,21.59 39.53,21.59 39.69,21.43 | IC8.2 20.95,38.1 21.11,38.26 21.11,43.81 20.88,44.05 16.43,44.05 | v10.16,46.99 9.68,46.51 9.05,46.51 IC7.1 | 39.69,21.43 39.37,21.43 IC6.13 | v51.12,18.57 47.78,18.57 44.93,21.43 39.69,21.43 | v51.28,54.61 53.34,54.61
  Bottom 0.203: J7.2 15.88,75.56 15.88,61.91 13.02,59.05 3.81,59.05 J8.2 3.81,53.34 v10.16,46.99 21.43,46.99 24.77,50.32 24.77,52.23 24.61,52.39 24.61,53.66 26.67,53.66 31.11,58.1 | J6.2 34.92,75.56 34.92,61.91 31.11,58.1 | J4.2 58.9,6.35 58.9,10.79 v51.12,18.57 | v51.28,54.61 50.8,54.61 46.51,50.32 35.88,50.32 35.88,52.23 36.04,52.39 36.04,53.18 31.11,58.1
MCU_SDA  (via drill 0.5)
  Top 0.203: IC2.4 53.66,47.94 53.5,48.1 | 53.5,48.1 R7.1 | v34.13,51.91 33.66,51.44 32.86,51.44 IC5.5 | v34.13,47.94 36.2,47.94 37.47,46.67 44.29,46.67 v45.72,48.1 | 53.5,48.1 v51.28,48.1
  Bottom 0.203: v34.13,47.94 v34.13,51.91 | v51.28,48.1 v45.72,48.1
MCU_SWCLK  (via drill 0.5)
  Top 0.203: v48.42,36.83 IC2.12 | v43.97,18.89 45.72,17.14 47.31,17.14 47.62,16.83 47.62,12.7 J3.2
  Bottom 0.203: v48.42,36.83 45.72,39.53 37.47,39.53 37.47,21.91 40.48,18.89 v43.97,18.89
MCU_SWIO  (via drill 0.5)
  Top 0.203: v50.01,35.56 IC2.13
  Bottom 0.203: v50.01,35.56 49.37,34.92 49.37,33.81 48.74,33.18 47.31,33.18 47.15,33.34 45.88,33.34 45.88,31.11 53.02,23.97 55.72,23.97 55.72,22.7 52.55,19.53 50.16,19.53 J3.4
MCU_TXD  (via drill 0.5)
  Top 0.203: IC2.10 48.1,39.37 v46.35,37.62 | v39.37,35.08 37.15,35.08 v31.75,29.69 | IC1.4 v31.75,26.35
  Bottom 0.203: v46.35,37.62 44.93,39.05 39.37,39.05 v39.37,35.08 | v31.75,26.35 v31.75,29.69
N$1
  Top 0.203: IC1.6 23.5,25.08 21.27,22.86 R1.1
N$2  (via drill 0.5)
  Top 0.203: J1.D- 16.18,24.46 v16.19,24.45 | R1.2 v18.1,22.54
  Bottom 0.203: v16.19,24.45 v18.1,22.54
N$3  (via drill 0.5)
  Top 0.203: J1.D+ 15.24,23.81 v15.88,23.18 | R2.2 v18.1,25.08 | v21.91,21.11 R3.2
  Bottom 0.203: v15.88,23.18 15.24,23.81 15.24,25.4 17.78,25.4 v18.1,25.08 18.1,24.92 v21.91,21.11
N$4
  Top 0.203: R2.1 22.23,25.08 23.5,26.35 IC1.5
N$5
  Top 0.203: LED1.C 11.75,14.61 R8.2
N$6  (via drill 0.5)
  Top 0.203: 24.45,22.23 24.77,22.54 IC1.8 24.45,22.23 | 24.45,22.23 23.81,21.59 R3.1 | v28.89,25.08 IC1.3 | 24.45,22.23 v25.24,21.43
  Bottom 0.203: v25.24,21.43 v28.89,25.08
N$7
  Top 0.508: C4.1 20.64,6.92 IC4.4
N$8
  Top 0.203: IC7.5 8.51,50.42 C7.1
N$9
  Top 0.508: S2.1 26.41,1.54 R5.2 25.4,1.91 25.19,2.12 22.58,2.12 22.49,2.2 IC4.1 22.5,4.45 24.13,4.45 24.13,6.35 22.5,6.35 IC4.3
N$10
  Top 0.203: LED2.C 11.75,10.79 R9.2
N$11
  Top 0.203: IC2.7 50.01,43.18 49.21,43.97 48.9,43.97 R10.2
N$12  (via drill 0.5)
  Top 0.203: R12.2 R11.1 v35.56,15.24 | v56.2,47.15 IC2.2
  Bottom 0.203: v56.2,47.15 35.56,47.15 v35.56,15.24
N$13
  Top 0.203: R21.2 LED3.C
N$14
  Top 0.203: Q1.3 R21.1
N$16
  Top 0.203: R22.2 LED4.C
N$17
  Top 0.203: Q2.3 R22.1
N$19
  Top 0.203: R23.2 LED5.C
N$20
  Top 0.203: R23.1 Q3.3
S0  (via drill 0.5)
  Top 0.203: v48.58,35.4 51.44,32.54 52.39,32.54 IC2.15 | v29.53,49.21 v36.51,42.23 | v28.26,51.59 27.78,52.07 26.99,52.07 IC5.11
  Bottom 0.203: v48.58,35.4 49.37,36.2 49.37,38.42 44.13,43.66 36.51,43.66 v36.51,42.23 | v29.53,49.21 28.26,50.48 v28.26,51.59
S1  (via drill 0.5)
  Top 0.203: IC2.18 56.2,31.11 49.53,24.45 v47.78,24.45 | v25.56,52.7 26.83,52.7 IC5.10
  Bottom 0.203: v47.78,24.45 44.93,21.59 44.93,18.57 40.64,14.29 32.7,14.29 32.7,44.77 25.56,51.91 v25.56,52.7
S2  (via drill 0.5)
  Top 0.203: IC2.16 53.66,32.07 53.02,31.43 51.12,31.43 v48.42,34.13 | v44.93,33.5 36.83,33.5 v34.13,30.8 | v28.26,52.86 27.78,53.34 26.99,53.34 IC5.9
  Bottom 0.203: v48.42,34.13 44.93,34.13 v44.93,33.5 | v34.13,30.8 33.18,31.75 33.18,47.94 v28.26,52.86
SDA1  (via drill 0.5)
  Top 0.203: 36.2,52.7 36.99,53.5 36.99,54.45 39.05,56.52 R14.1 | 36.2,52.7 34.29,50.8 32.86,50.8 IC5.4 | v42.7,14.92 41.75,14.92 v34.61,22.07 | 36.2,52.7 v35.08,52.7
  Bottom 0.203: J4.4 58.9,3.81 58.26,3.17 42.7,3.17 v42.7,14.92 | v34.61,22.07 35.08,22.54 v35.08,52.7
SDA2  (via drill 0.5)
  Top 0.203: 37.94,53.66 34.45,50.16 32.86,50.16 IC5.3 | R13.1 37.94,53.66 | 37.94,53.66 v39.37,55.09
  Bottom 0.203: J5.4 54.93,77.15 51.12,77.15 51.12,73.03 52.7,71.44 52.7,61.91 45.88,55.09 v39.37,55.09
SDA3  (via drill 0.5)
  Top 0.203: 36.83,49.85 R15.1 | 36.83,49.85 36.51,49.53 32.86,49.53 IC5.2 | 36.83,49.85 v36.83,51.28
  Bottom 0.203: v36.83,51.28 36.83,52.55 | 36.83,52.55 J6.3 | J5.3 53.18,74.77 53.18,61.59 44.13,52.55 36.83,52.55
SDA4  (via drill 0.5)
  Top 0.203: 36.99,48.9 37.15,48.9 R16.1 | 36.99,48.9 32.86,48.9 IC5.1 | v41.27,53.5 41.27,47.94 40.48,47.15 38.73,47.15 36.99,48.9
  Bottom 0.203: J6.4 37.78,75.88 37.78,55.4 39.69,53.5 v41.27,53.5
SDA5
  Top 0.203: R17.1 22.86,49.53 26.83,49.53 IC5.15 26.99,49.53 27.78,49.53 29.21,50.96 29.21,53.18 28.42,53.98 27.62,53.98 19.05,62.55 J7.4
SDA6  (via drill 0.5)
  Top 0.203: 23.65,50.64 R18.1 | 23.65,50.64 24.13,50.16 26.83,50.16 IC5.14 | v23.65,50.48 23.65,50.64
  Bottom 0.203: J8.3 6.51,58.58 14.61,58.58 | 14.61,58.58 16.19,58.58 16.19,61.44 17.78,63.02 J7.3 | v23.65,50.48 14.61,50.48 14.61,58.58
SDA7  (via drill 0.5)
  Top 0.203: 23.81,52.39 22.54,53.66 R19.1 | 23.81,52.39 25.4,50.8 26.83,50.8 IC5.13 | J8.4 7.3,58.1 v17.78,58.1 | 23.81,52.39 v23.81,51.91
  Bottom 0.203: v17.78,58.1 18.41,57.47 18.41,55.72 22.23,51.91 v23.81,51.91
SDA8  (via drill 0.5)
  Top 0.203: v21.27,58.26 22.38,57.15 22.38,56.83 R20.1 23.65,55.72 23.65,53.34 25.56,51.44 26.83,51.44 IC5.12 | IC7.4 9.05,48.1 9.05,48.42 16.67,56.04 v19.37,56.04 v19.37,49.21 | IC8.4 20,39.69 v19.68,40.01 | v21.91,40.8 v21.91,42.55 21.91,46.67 v20.8,47.78 | IC6.14 40.32,23.08 v40.32,22.23 | v38.42,37.15 37.47,37.15 35.88,38.73 31.75,38.73 31.11,39.37 31.11,40.64 v29.21,42.55
  Bottom 0.203: v19.37,56.04 21.27,57.94 v21.27,58.26 | v19.68,40.01 20.48,40.8 v21.91,40.8 | v19.37,49.21 v20.8,47.78 | v40.32,22.23 38.42,24.13 38.42,30.16 v38.42,37.15 | v21.91,42.55 v29.21,42.55
V+
  Top 0.203: C2.+ 37.15,8.8 R11.2
  Top 0.508: 29.87,10.53 S2.2 | J2.2 36.27,7.93 C2.+ 31.48,8.57 S2.2 | IC3.3 21.59,14.29 22.86,15.56 26.99,15.56 27.3,15.24 27.3,11.43 28.21,10.53 S2.2